# Altium schematic sheet KV2_MotionA56.SchDoc
size A3; PageSetup: Record=PageOptions|CenterHorizontal=True|CenterVertical=True|PrintScale=1.00|XCorrection=1.00|YCorrection=1.00|PrintKind=2|BorderSize=5000000|LeftOffset=0|BottomOffset=0|Orientation=2|PaperLength=1000|PaperWidth=1000|Scale=100|PaperSource=7|PrintQuality=-4|MediaType=1|DitherType=10|PaperKind=A3|PrintScaleMode=1
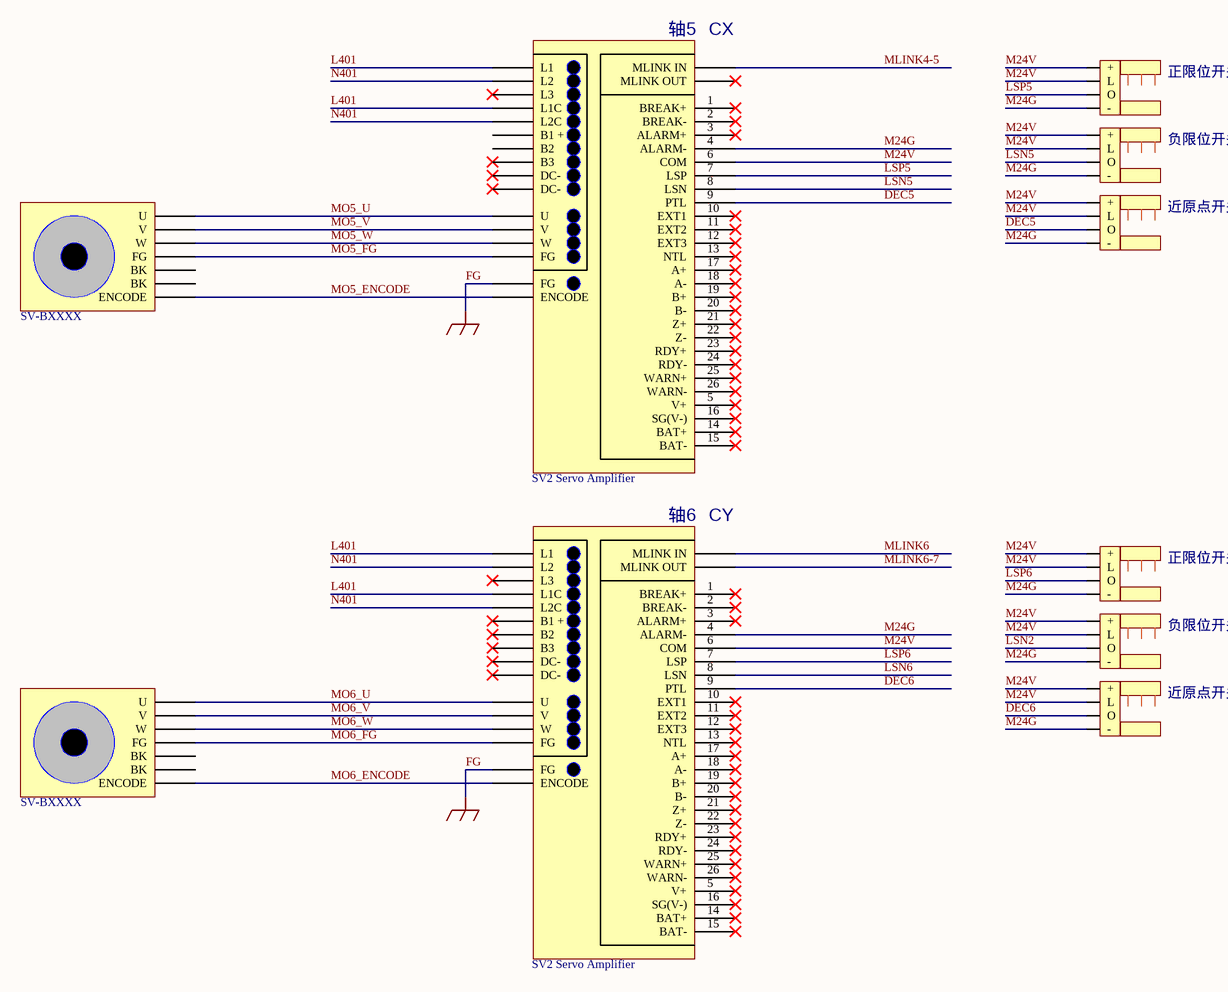
[diagram p0: KV2_MotionA56.SchDoc]

## Parts
(Parts that share a designator on the sheet are numbered #1, #2 ... from top to bottom, then left to right.)
*#1  SV2 Servo Amplifier
*#2  SV-BXXXX
*#3  SV2 Servo Amplifier
*#4  SV-BXXXX
原点光纤传感器#1  OMRON  E3X-HD  (value not drawn)
原点光纤传感器#2  OMRON  E3X-HD  (value not drawn)
原点光纤传感器#3  OMRON  E3X-HD  (value not drawn)
原点光纤传感器#4  OMRON  E3X-HD  (value not drawn)
原点光纤传感器#5  OMRON  E3X-HD  (value not drawn)
原点光纤传感器#6  OMRON  E3X-HD  (value not drawn)

## Nets
FG: *#1.X43(FG) *#3.X43(FG)  [also labelled GND]
DEC5: *#1.9(PTL) 原点光纤传感器#3.91(O)
DEC6: *#3.9(PTL) 原点光纤传感器#6.91(O)
L401: *#1.X34(L1) *#1.X37(L1C) *#3.X34(L1) *#3.X37(L1C)
LSN2: 原点光纤传感器#5.91(O)
LSN5: *#1.8(LSN) 原点光纤传感器#2.91(O)
LSN6: *#3.8(LSN)
LSP5: *#1.7(LSP) 原点光纤传感器#1.91(O)
LSP6: *#3.7(LSP) 原点光纤传感器#4.91(O)
M24G: *#1.4(ALARM-) *#3.4(ALARM-) 原点光纤传感器#1.92(-) 原点光纤传感器#2.92(-) 原点光纤传感器#3.92(-) 原点光纤传感器#4.92(-) 原点光纤传感器#5.92(-) 原点光纤传感器#6.92(-)
M24V: *#1.6(COM) *#3.6(COM) 原点光纤传感器#1.89(+) 原点光纤传感器#1.90(L) 原点光纤传感器#2.89(+) 原点光纤传感器#2.90(L) 原点光纤传感器#3.89(+) 原点光纤传感器#3.90(L) 原点光纤传感器#4.89(+) 原点光纤传感器#4.90(L) 原点光纤传感器#5.89(+) 原点光纤传感器#5.90(L) 原点光纤传感器#6.89(+) 原点光纤传感器#6.90(L)
MLINK4-5: *#1.X44(MLINK_IN)
MLINK6: *#3.X44(MLINK_IN)
MLINK6-7: *#3.X44(MLINK_OUT)
MO5_ENCODE: *#1.X44(ENCODE) *#2.29(ENCODE)
MO5_FG: *#1.X43(FG) *#2.29(FG)
MO5_U: *#1.X43(DC-) *#2.27(U)
MO5_V: *#1.X43(V) *#2.28(V)
MO5_W: *#1.X43(W) *#2.29(W)
MO6_ENCODE: *#3.X44(ENCODE) *#4.29(ENCODE)
MO6_FG: *#3.X43(FG) *#4.29(FG)
MO6_U: *#3.X43(DC-) *#4.27(U)
MO6_V: *#3.X43(V) *#4.28(V)
MO6_W: *#3.X43(W) *#4.29(W)
N401: *#1.X35(L2) *#1.X38(L2C) *#3.X35(L2) *#3.X38(L2C)

Not connected (* = marked no-connect by the designer): *#1 1(BREAK+)* 2(BREAK-)* 3(ALARM+)* 5(V+)* 10(EXT1)* 11(EXT2)* 12(EXT3)* 13(NTL)* 14(BAT+)* 15(BAT-)* 16(SG(V-))* 17(A+)* 18(A-)* 19(B+)* 20(B-)* 21(Z+)* 22(Z-)* 23(RDY+)* 24(RDY-)* 25(WARN+)* 26(WARN-)* X36(L3)* X39(B1_+) X40(B2) X41(B3)* X42(DC-)*; *#2 30(BK) 31(BK); *#3 1(BREAK+)* 2(BREAK-)* 3(ALARM+)* 5(V+)* 10(EXT1)* 11(EXT2)* 12(EXT3)* 13(NTL)* 14(BAT+)* 15(BAT-)* 16(SG(V-))* 17(A+)* 18(A-)* 19(B+)* 20(B-)* 21(Z+)* 22(Z-)* 23(RDY+)* 24(RDY-)* 25(WARN+)* 26(WARN-)* X36(L3)* X39(B1_+)* X40(B2)* X41(B3)* X42(DC-)*; *#4 30(BK) 31(BK)

## Notes on the sheet
- (near *#1) 轴5
- (near *#1) CX
- 正限位开关
- 负限位开关
- 近原点开关
- (near *#3) 轴6
- (near *#3) CY

## Library data of the parts
原点光纤传感器#1-原点光纤传感器#6 = OMRON_EE-SX671